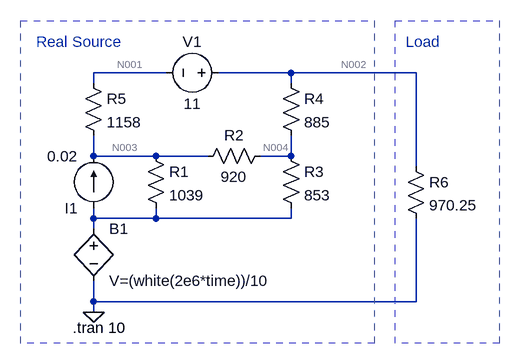
[diagram p0: schematic Var72.asc]
Var72.asc, the LTspice schematic file:
Version 4
SHEET 1 896 680
WIRE 224 -112 112 -112
WIRE 416 -112 304 -112
WIRE 608 -112 416 -112
WIRE 112 -96 112 -112
WIRE 416 -96 416 -112
WIRE 112 16 112 -16
WIRE 208 16 112 16
WIRE 288 16 208 16
WIRE 416 16 416 -16
WIRE 416 16 368 16
WIRE 608 32 608 -112
WIRE 112 112 112 96
WIRE 208 112 208 96
WIRE 208 112 112 112
WIRE 416 112 416 96
WIRE 416 112 208 112
WIRE 112 128 112 112
WIRE 112 240 112 208
WIRE 608 240 608 112
WIRE 608 240 112 240
WIRE 112 256 112 240
FLAG 112 256 0
SYMBOL bv 112 112 R0
SYMATTR InstName B1
SYMATTR Value V=(white(2e6*time))/10
SYMBOL current 112 96 R180
WINDOW 123 0 0 Left 0
WINDOW 39 0 0 Left 0
SYMATTR InstName I1
SYMATTR Value 0.02
SYMBOL res 192 0 R0
SYMATTR InstName R1
SYMATTR Value 1039
SYMBOL res 384 0 R90
WINDOW 0 0 56 VBottom 2
WINDOW 3 32 56 VTop 2
SYMATTR InstName R2
SYMATTR Value 920
SYMBOL res 400 0 R0
SYMATTR InstName R3
SYMATTR Value 853
SYMBOL res 400 -112 R0
SYMATTR InstName R4
SYMATTR Value 885
SYMBOL res 96 -112 R0
SYMATTR InstName R5
SYMATTR Value 1158
SYMBOL voltage 320 -112 R90
WINDOW 0 -32 56 VBottom 2
WINDOW 3 32 56 VTop 2
WINDOW 123 0 0 Left 0
WINDOW 39 0 0 Left 0
SYMATTR InstName V1
SYMATTR Value 11
SYMBOL res 592 16 R0
SYMATTR InstName R6
SYMATTR Value 970.25
TEXT 80 280 Left 2 !.tran 10
TEXT 24 -160 Left 2 ;Real Source
TEXT 592 -160 Left 2 ;Load
RECTANGLE Normal 544 304 0 -192 1
RECTANGLE Normal 736 304 576 -192 1

The netlist it stands for:
* Var72.asc
B1 N005 0 V=(white(2e6*time))/10
I1 N005 N003 0.02
R1 N003 N005 1039
R2 N004 N003 920
R3 N004 N005 853
R4 N002 N004 885
R5 N001 N003 1158
V1 N002 N001 11
R6 N002 0 970.25
.tran 10
* Real Source
* Load
.backanno
.end

* Results of the author's LTspice run, read from the files saved beside the schematic
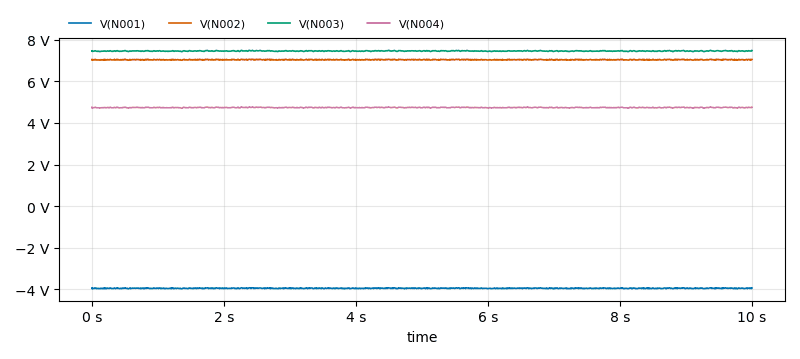
[diagram p1: Transient Analysis of Var72.asc, plotted from the saved traces]
* Transient Analysis, 1 run:
*   V(N001): min -3.981 V, max -3.932 V, average -3.956 V, rms 3.956 V, last -3.941 V
*   V(N002): min 7.019 V, max 7.068 V, average 7.044 V, rms 7.044 V, last 7.059 V
*   V(N003): min 7.431 V, max 7.494 V, average 7.463 V, rms 7.463 V, last 7.485 V
*   V(N004): min 4.71 V, max 4.773 V, average 4.742 V, rms 4.742 V, last 4.764 V